# EAGLE design zad1_hw (EAGLE 9.6.2)
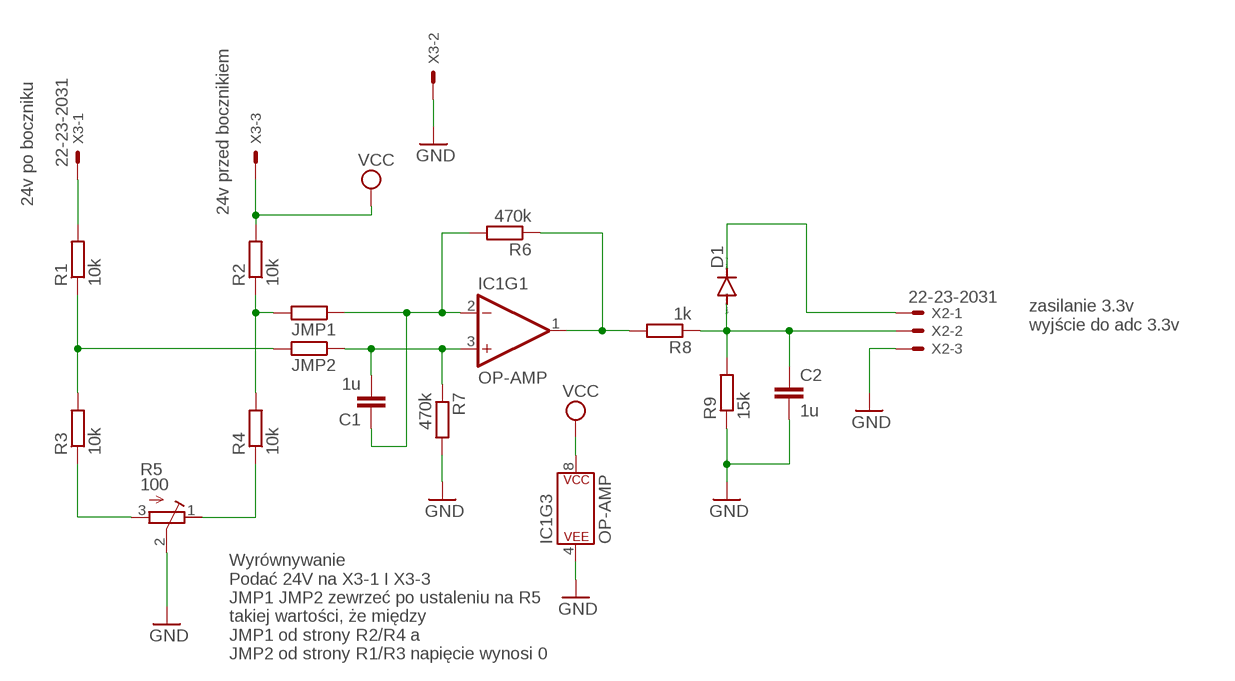
[diagram p0: schematic, sheet 1]

## Parts
C1  1u  C-EUC1206  [C1206]
C2  1u  C-EUC1206  [C1206]
D1  DIODE-DO214AC  [DO214AC]
IC1  OP-AMP  OPAMP-DUALU  [SO08]
JMP1  0  R-EU_R1206  [R1206]
JMP2  0  R-EU_R1206  [R1206]
R1  10k  R-EU_R1206  [R1206]
R2  10k  R-EU_R1206  [R1206]
R3  10k  R-EU_R1206  [R1206]
R4  10k  R-EU_R1206  [R1206]
R5  100  R-TRIMMT93YA  [RTRIMT93YA]
R6  470k  R-EU_R1206  [R1206]
R7  470k  R-EU_R1206  [R1206]
R8  1k  R-EU_R1206  [R1206]
R9  15k  R-EU_R1206  [R1206]
X2  22-23-2031  [22-23-2031]
X3  22-23-2031  [22-23-2031]

## Nets
GND: C2.2 IC1.4(P$V-) R5.2(S) R7.2 R9.1 X2.3 X3.2
N$1: R3.1 R5.3(A)
N$2: R4.1 R5.1(E)
N$3: JMP1.2 R2.1 R4.2
N$4: JMP2.2 R1.1 R3.2
N$5: R1.2 X3.1
N$6: D1.C X2.1
N$7: C1.1 IC1.2(-IN) JMP1.1 R6.2
N$8: C1.2 IC1.3(+IN) JMP2.1 R7.1
N$9: IC1.1(OUT) R6.1 R8.2
N$10: C2.1 D1.A R8.1 R9.2 X2.2
VCC: IC1.8(P$V+) R2.2 X3.3
Unconnected: IC1.5(+IN) IC1.6(-IN) IC1.7(OUT)

## Notes on the sheet
- 24v po boczniku
- 24v przed bocznikiem
- zasilanie 3.3v
  wyjście do adc 3.3v
- Wyrównywanie
  Podać 24V na X3-1 I X3-3
  JMP1 JMP2 zewrzeć po ustaleniu na R5
  takiej wartości, że między
  JMP1 od strony R2/R4 a
  JMP2 od strony R1/R3 napięcie wynosi 0

## Library data of the parts
C1 C2 = rcl:C-EU: CAPACITOR, European symbol; SPICEPREFIX: C
D1 = diode:DIODE-: DIODE
IC1 = SparkFun-IC-Amplifiers:OPAMP-DUAL: Generic op-amp footprint This component is for the standard 358 pinning of a dual op-amp From the LM358 datasheet: Pin 1: Output A Pin 2: Inverting Input A Pin 3: Non-Inverting Input A Pin 4: Gnd Pin 5: Non-Inverting Input B Pin 6: Inverting Input B Pin 7: Output B Pin 8: V+; PROD_ID: NA-XXXXX
JMP1 JMP2 R1-R4 R6-R9 = rcl:R-EU_: RESISTOR, European symbol; SPICEPREFIX: R
R5 = rcl:R-TRIMM: Trimm resistor; SPICEMODEL: X; SPICEPREFIXL: POT
X2 X3 = con-molex:22-23-2031: .100" (2.54mm) Center Header - 3 Pin; MF: MOLEX; MPN: 22-23-2031; OC_FARNELL: 1462950; OC_NEWARK: 30C0862

## Board
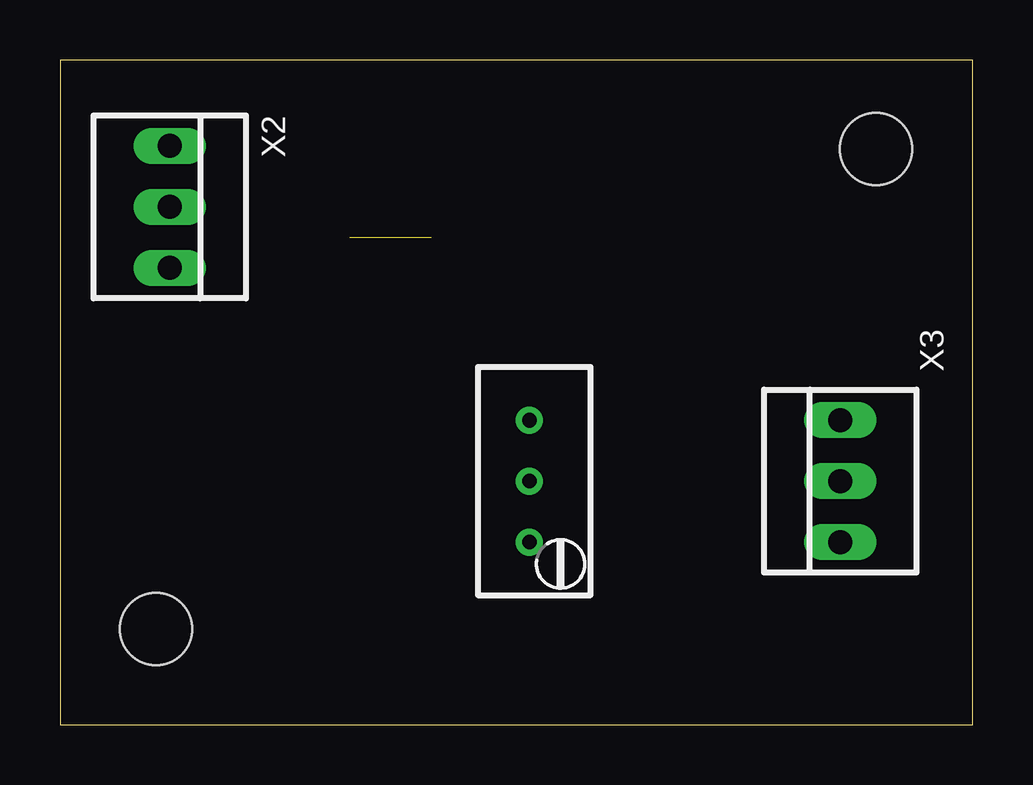
[diagram p1: board, top side]
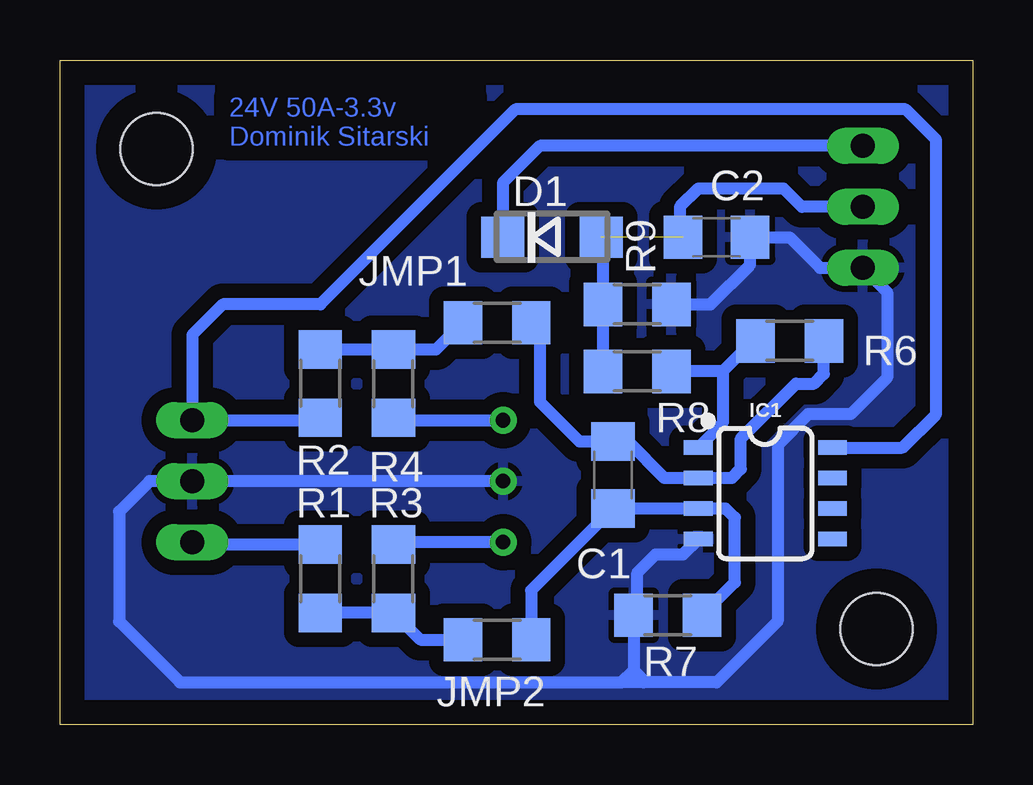
[diagram p2: board, bottom side, seen from below]

Size 38.02 x 27.71 mm. Coordinates in mm from the lower left corner, seen from the top.
Outline: 0,0 38.02,0 38.02,27.71 0,27.71 0,0
Copper layers (1*16): Top 0.035mm / dielectric 1.5mm / Bottom 0.035mm
Design rules "default": minimum track width 6mil, minimum drill 0.35mm, track to track 6mil, track to pad 6mil, pad to pad 6mil, via to via 6mil, smd to smd 6mil, copper to edge 40mil, drill to drill 6mil, minimum pad ring 10mil, minimum via ring 8mil, stop-mask expansion 4mil, vias tented up to drill 0mil, thermal gap 10mil
Holes 3 mm at 4,4 34,24

### Footprints (pad centres in the part's own frame; a part is rotated, then mirrored left to right if it is on the bottom)
C1206 = smd 1.6 x 1.8: 1 -1.4,0; 2 1.4,0
DO214AC = smd 1.8 x 1.7: A 2.05,0; C -2.05,0
SO08 = smd 0.6 x 1.2: 1 -1.905,-2.8; 2 -0.635,-2.8; 3 0.635,-2.8; 4 1.905,-2.8; 5 1.905,2.8; 6 0.635,2.8; 7 -0.635,2.8; 8 -1.905,2.8
R1206 = smd 1.6 x 1.803: 1 -1.422,0; 2 1.422,0
RTRIMT93YA = drill 0.61: 1 0,-2.54; 2 0,0; 3 0,2.54
22-23-2031 = drill 1 long: 1 -2.54,0; 2 0,0; 3 2.54,0

### Placement (x,y rotation side)
C1  14.99,10.41 270 bottom
C2  10.67,20.32 0 bottom
D1  17.53,20.32 0 bottom
IC1  8.64,9.65 270 bottom
JMP1  19.81,16.76 180 bottom
JMP2  19.81,3.56 180 bottom
R1  27.18,6.1 90 bottom
R2  27.18,14.22 270 bottom
R3  24.13,6.1 270 bottom
R4  24.13,14.22 90 bottom
R5  19.56,10.16 180 top
R6  7.62,16 0 bottom
R7  12.7,4.57 180 bottom
R8  13.97,14.73 0 bottom
R9  13.97,17.53 180 bottom
X2  4.57,21.59 270 top
X3  32.51,10.16 90 top

### Tracks (layer width: path | path; a pad name or v marks a point on that pad's centre or on a via)
GND
  Bottom 0.508: R5.2 X3.2 34.29,10.16 35.56,8.89 35.56,4.32 33.02,1.78 14.63,1.78 | IC1.4 12.07,7.11 13.21,7.11 13.97,6.35 13.97,4.72 R7.2 14.12,2.29 | 14.63,1.78 14.12,2.29 | 13.72,1.78 10.67,1.78 8.13,4.32 8.13,11.68 6.86,12.95 5.08,12.95 3.56,14.48 3.56,18.03 X2.3 6.35,19.05 7.62,20.32 C2.2 | 13.72,1.78 14.63,1.78 | 14.12,2.29 13.72,1.88 13.72,1.78 | 9.21,20.26 C2.2 | R9.1 10.92,17.53 9.27,19.18 C2.2
  pour Bottom (isolate 0.61): 0,27.69 37.85,27.69 37.85,0 0,0
N$1
  Bottom 0.508: R5.3 24.03,7.62 R3.1
N$2
  Bottom 0.508: R4.1 24.03,12.7 R5.1
N$3
  Bottom 0.508: R2.1 R4.2 22.35,15.65 JMP1.2
N$4
  Bottom 0.508: JMP2.2 23.01,3.56 R3.2 R1.1
N$5
  Bottom 0.508: R1.2 32.41,7.52 X3.1
N$6
  Bottom 0.508: X2.1 18.03,24.13 19.58,22.59 D1.C
N$7
  Bottom 0.508: 6.1,15.9 R6.2 6.2,14.63 6.6,14.22 7.37,14.22 9.65,11.94 9.65,10.67 10.03,10.29 IC1.2 12.83,10.29 14.35,11.81 C1.1 16.39,11.81 18.03,13.46 18.03,16.41 JMP1.1
N$8
  Bottom 0.508: JMP2.1 18.39,5.61 C1.2 IC1.3 10.29,9.02 9.91,8.64 9.91,5.94 R7.1
N$9
  Bottom 0.508: 11.44,11.58 IC1.1 10.41,12.58 10.41,14.73 | R6.1 9.14,16 10.41,14.73 | 10.41,14.73 R8.2
N$10  (1 unrouted)
  Bottom 0.508: R8.1 R9.2 | R9.2 15.48,17.61 | R9.2 15.39,20.24 D1.A | X2.2 7.11,21.59 7.87,22.35 11.43,22.35 12.19,21.59 12.19,20.44 C2.1
VCC
  Bottom 0.508: X3.3 32.26,12.7 | 32.26,12.7 27.28,12.7 R2.2 | IC1.8 2.92,11.56 1.52,12.95 1.52,24.38 2.79,25.65 19.05,25.65 27.18,17.53 31.24,17.53 32.51,16.26 32.51,12.95 32.26,12.7

### Text on the board
Bottom: 24V 50A-3.3v / Dominik Sitarski